# Altium schematic sheet TDesktop.SchDoc: LiveDesign Evaluation - Countdown
size A4; Organization: Altium Limited; Address1: L3, 12a Rodborough Rd; Address2: Frenchs Forest; Address3: NSW; Address4: Australia 2086; DocumentNumber: 9; SheetNumber: 9; SheetTotal: 11
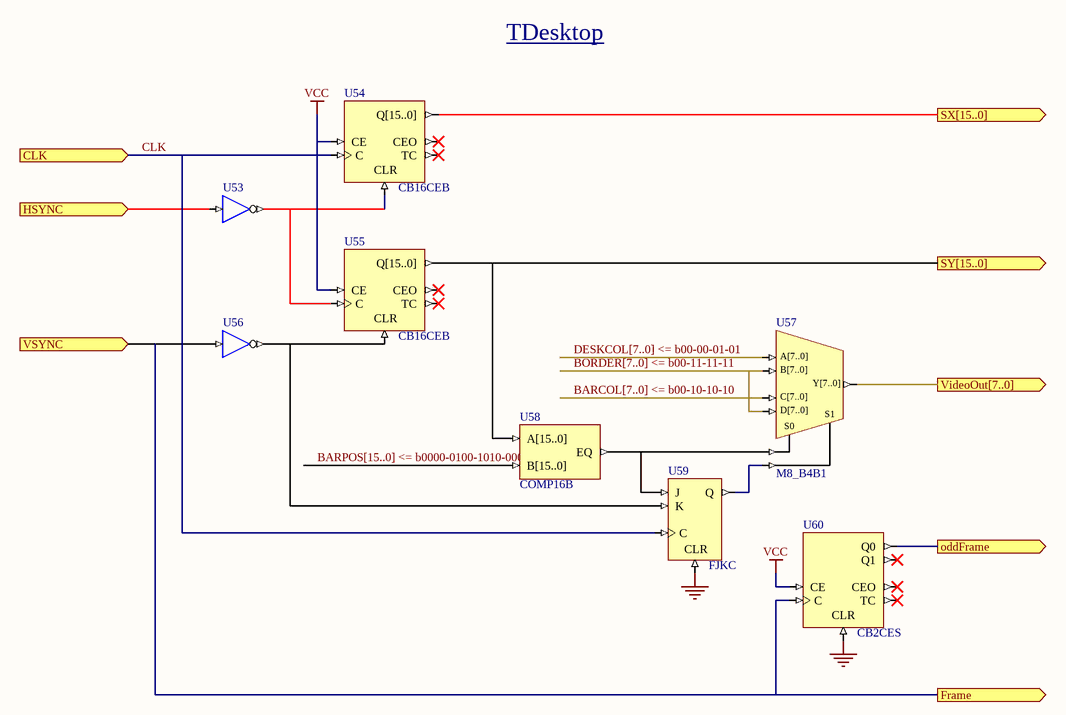
[diagram p0: TDesktop.SchDoc]

## Parts
U53  INV  (value not drawn)
U54  CB16CEB
U55  CB16CEB
U56  BUF  (value not drawn)
U57  M8_B4B1
U58  COMP16B
U59  FJKC
U60  CB2CES

## Ports
CLK (in), Frame (out), HSYNC (in), oddFrame (out), SX[15..0] (out), SY[15..0] (out), VideoOut[7..0] (out), VSYNC (in)

## Nets
GND: U59.CLR U60.CLR
VCC: U54.CE U55.CE U60.CE
BARCOL[7..0] <= b00-10-10-10: U57.C[7..0]
BARPOS[15..0] <= b0000-0100-1010-000: U58.B[15..0]
BORDER[7..0] <= b00-11-11-11: U57.B[7..0] U57.D[7..0]
CLK: U54.C U59.C ; port CLK
DESKCOL[7..0] <= b00-00-01-01: U57.A[7..0]
Frame: U56.I U60.C ; port VSYNC, port Frame
HSYNC: U53.I ; port HSYNC
oddFrame: U60.Q0 ; port oddFrame
SX[15..0]: U54.Q[15..0] ; port SX[15..0]
SY[15..0]: U55.Q[15..0] U58.A[15..0] ; port SY[15..0]
VideoOut[7..0]: U57.Y[7..0] ; port VideoOut[7..0]
NetU53_O: U53.O U54.CLR U55.C
NetU55_CLR: U55.CLR U56.O U59.K
NetU57_S0: U57.S0 U58.EQ U59.J
NetU57_S1: U57.S1 U59.Q

Not connected (* = marked no-connect by the designer): U54 CEO* TC*; U55 CEO* TC*; U60 CEO* Q1* TC*

## Buses and harness runs
bus BARCOL[7..0] <= b00-10-10-10
bus BARPOS[15..0] <= b0000-0100-1010-000
bus BORDER[7..0] <= b00-11-11-11
bus DESKCOL[7..0] <= b00-00-01-01

## Notes on the sheet
- TDesktop
- Title
- Size:
- Date:
- A4
- Number:
- Time:
- Revision:
- Sheet
- of
- File:

## Library data of the parts
U53 U56 = INV: Inverter; ArchiveName: GENERIC; VHDLIB_SIM: GENERIC_LIB; Published: 29-Jan-2004; Publisher: Altium Limited; Xilinx Equivalent: INV; Core Revision: 1.00.00
U54 U55 = CB16CEB: 16-Bit Cascadable Binary Counters with Clock Enable and Asynchronous Clear, Bus Version; Xilinx Equivalent: CB16CE; ArchiveName: GENERIC; VHDLIB_SIM: GENERIC_LIB; Published: 29-Jan-2004; Publisher: Altium Limited; Core Revision: 1.00.00
U57 = M8_B4B1: 4x8-Bit Bus to 1x8-Bit Bus Multiplexer; ArchiveName: GENERIC; VHDLIB_SIM: GENERIC_LIB; Published: 29-Jan-2004; Publisher: Altium Limited; Core Revision: 1.00.00
U58 = COMP16B: 16-Bit Identity Comparator, Bus Version; Xilinx Equivalent: COMP16; ArchiveName: GENERIC; VHDLIB_SIM: GENERIC_LIB; Published: 29-Jan-2004; Publisher: Altium Limited; Core Revision: 1.00.00
U59 = FJKC: J-K Flip-Flop with Asynchronous Clear; ArchiveName: GENERIC; VHDLIB_SIM: GENERIC_LIB; Published: 29-Jan-2004; Publisher: Altium Limited; Xilinx Equivalent: FJKC; Core Revision: 1.00.00
U60 = CB2CES: 2-Bit Cascadable Binary Counters with Clock Enable and Asynchronous Clear, Single Pin Version; Xilinx Equivalent: CB2CE; ArchiveName: GENERIC; VHDLIB_SIM: GENERIC_LIB; Published: 29-Jan-2004; Publisher: Altium Limited; Core Revision: 1.00.00